# EAGLE design mini64se-v1.0.9-103-2s (EAGLE 6.3)
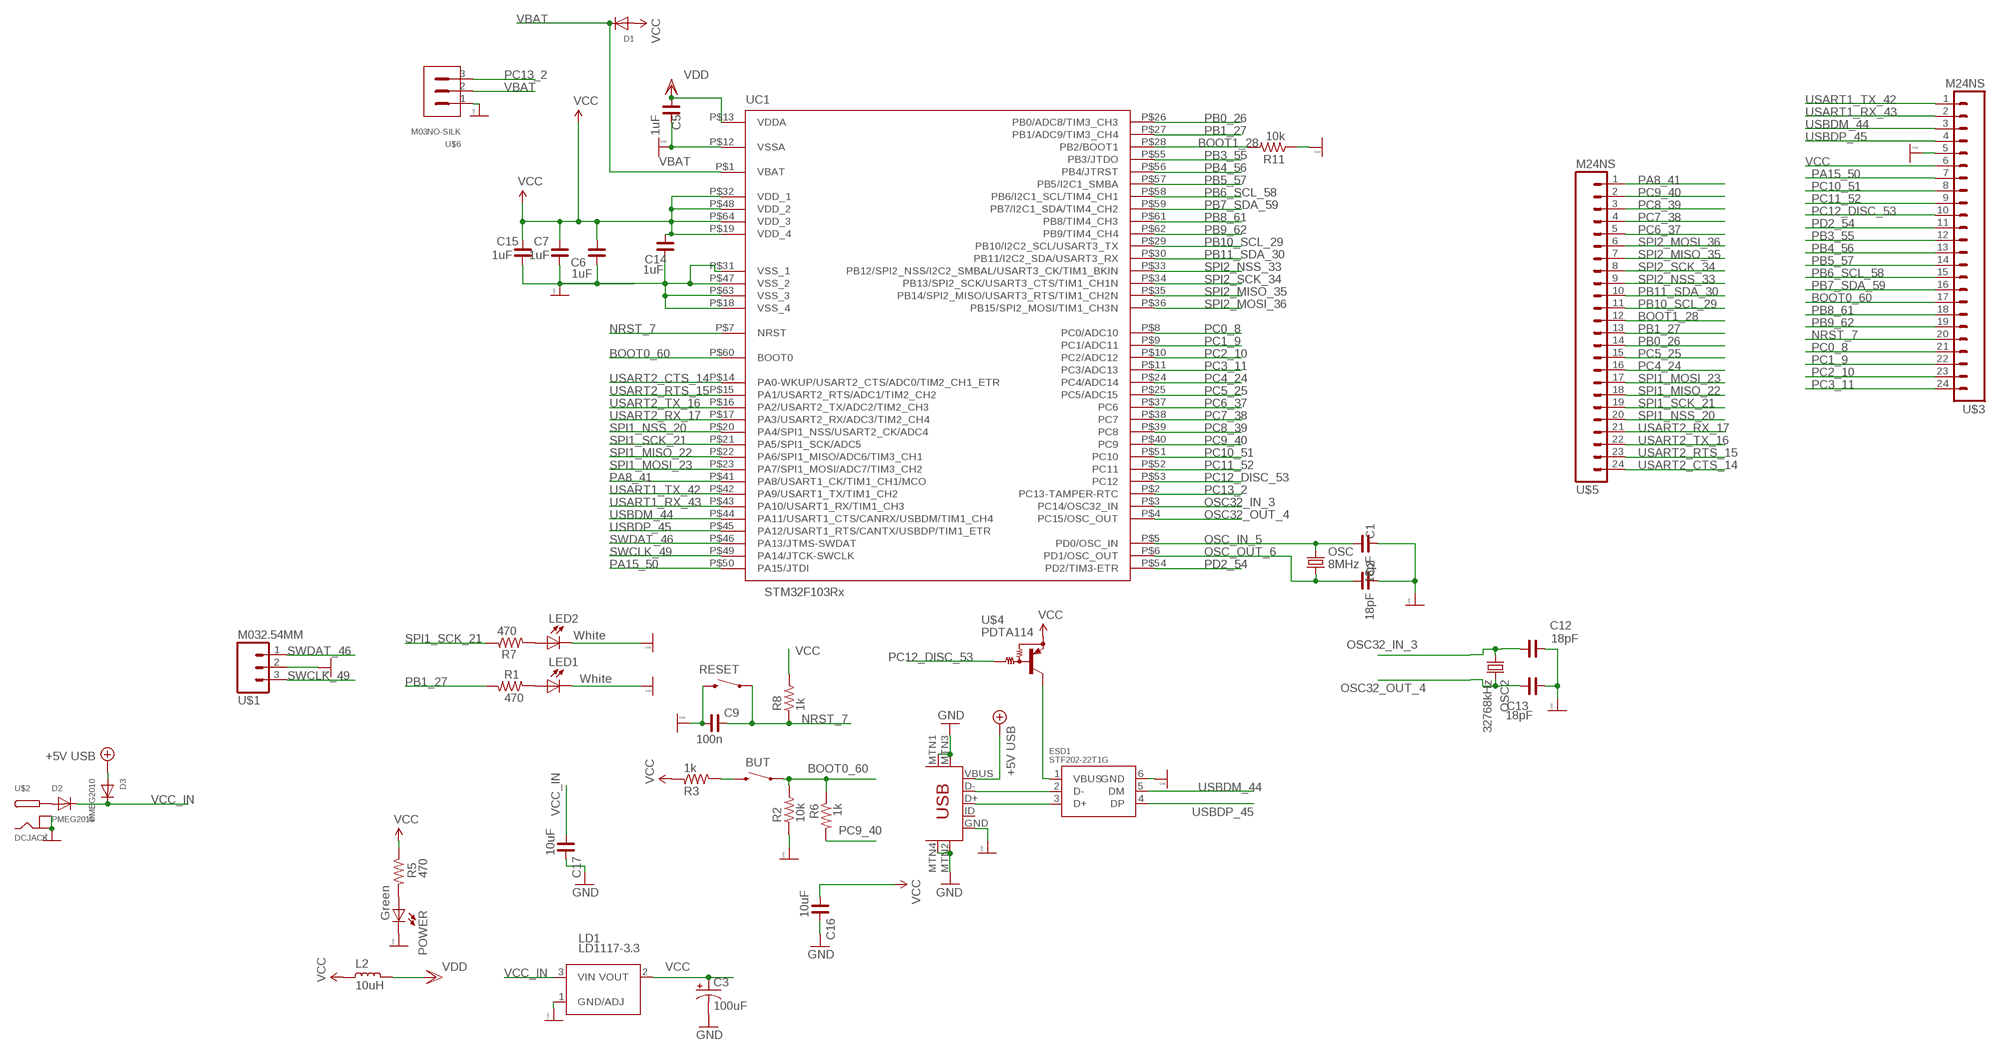
[diagram p0: schematic, sheet 1]

## Parts
BUT  SWITCH-MOMENTARY-2SMD  [TACTILE_SWITCH_SMD]
C1  18pF  C_0603  [C0603]
C2  18pF  C_0603  [C0603]
C3  100uF  CAP_POLC  [PANASONIC_C]
C5  1uF  C_0603  [C0603]
C6  1uF  C_0603  [C0603]
C7  1uF  C_0603  [C0603]
C9  100n  C_0603  [C0603]
C12  18pF  C_0603  [C0603]
C13  18pF  C_0603  [C0603]
C14  1uF  C_0603  [C0603]
C15  1uF  C_0603  [C0603]
C16  10uF  C_0805  [C0805]
C17  10uF  C_0805  [C0805]
D1  DIODESOD-323  [SOD-323]
D2  PMEG2010  DIODESOD-323  [SOD-323]
D3  PMEG2010  DIODESOD-323  [SOD-323]
ESD1  STF202-22T1G  STF202TSOP-6  [TSOP-6]
L2  10uH  L_PM0603  [PM0603]
LD1  LD1117-3.3  LD1117SOT223  [SOT223]
LED1  White  LEDKA-3528ASYC  [KA-3528ASYC]
LED2  White  LEDKA-3528ASYC  [KA-3528ASYC]
OSC  8MHz  CRYSTALHC49UV  [HC49U-V]
OSC2  32768kHz  CRYSTALTC26HM  [TC26H-M]
POWER  Green  LEDCHIPLED_0603  [CHIPLED_0603]
R1  470  R_0603  [R0603]
R2  10k  R_0603  [R0603]
R3  1k  R_0603  [R0603]
R5  470  R_0603  [R0603]
R6  1k  R_0603  [R0603]
R7  470  R_0603  [R0603]
R8  1k  R_0603  [R0603]
R11  10k  R_0603  [R0603]
RESET  SWITCH-MOMENTARY-2SMD  [TACTILE_SWITCH_SMD]
U$1  M032.54MM  M031X03_NO_SILK  [1X03_NO_SILK]
U$2  DCJACK  [DC-020-001]
U$3  M24NS  [1X24_NO_SILK]
U$4  PDTA114  PNP-DRIVERSOT23-3  [SOT23-3]
U$5  M24NS  [1X24_NO_SILK]
U$6  M03NO-SILK  [1X03_NO_SILK]
UC1  STM32F103Rx  STM32F103  [TQFP-10X10-64]
USB  USB-MINIB-5PIN  [USB-MINIB]

## Nets
+5V [vcc]: D3.A USB.VBUS ; supply symbol labelled +5V USB
BOOT0_60: BUT.1 R2.2 R6.1 U$3.17 UC1.P$60(BOOT0)
BOOT1_28: R11.2 U$5.12 UC1.P$28(PB2/BOOT1)
GND: C1.1 C2.1 C3.- C5.1 C6.1 C7.1 C9.1 C12.1 C13.1 C14.1 C15.1 C16.2 C17.2 ESD1.6(GND) LD1.1(GND/ADJ) LED1.C LED2.C POWER.C R2.1 R11.1 RESET.3 U$1.2 U$2.GND U$2.GNDBREAK U$3.5 U$6.1 UC1.P$12(VSSA) UC1.P$18(VSS_4) UC1.P$31(VSS_1) UC1.P$47(VSS_2) UC1.P$63(VSS_3) USB.GND USB.MTN1(MTN2) USB.MTN2(MTN3) USB.MTN3(MTN1) USB.MTN4
N$1: POWER.A R5.2
N$2: BUT.3 R3.2
N$3: LED2.A R7.2
N$4: LED1.A R1.1
N$5: ESD1.1(VBUS) U$4.3(C)
N$6: D2.A U$2.PWR
N$14: ESD1.2(D-) USB.D-
N$17: ESD1.3(D+) USB.D+
NRST_7: C9.2 R8.1 RESET.1 U$3.20 UC1.P$7(NRST)
OSC32_IN_3: C12.2 OSC2.1 UC1.P$3(PC14/OSC32_IN)
OSC32_OUT_4: C13.2 OSC2.2 UC1.P$4(PC15/OSC_OUT)
OSC_IN_5: C1.2 OSC.2 UC1.P$5(PD0/OSC_IN)
OSC_OUT_6: C2.2 OSC.1 UC1.P$6(PD1/OSC_OUT)
PA8_41: U$5.1 UC1.P$41(PA8/USART1_CK/TIM1_CH1/MCO)
PA15_50: U$3.7 UC1.P$50(PA15/JTDI)
PB0_26: U$5.14 UC1.P$26(PB0/ADC8/TIM3_CH3)
PB1_27: R1.2 U$5.13 UC1.P$27(PB1/ADC9/TIM3_CH4)
PB3_55: U$3.12 UC1.P$55(PB3/JTDO)
PB4_56: U$3.13 UC1.P$56(PB4/JTRST)
PB5_57: U$3.14 UC1.P$57(PB5/I2C1_SMBA)
PB6_SCL_58: U$3.15 UC1.P$58(PB6/I2C1_SCL/TIM4_CH1)
PB7_SDA_59: U$3.16 UC1.P$59(PB7/I2C1_SDA/TIM4_CH2)
PB8_61: U$3.18 UC1.P$61(PB8/TIM4_CH3)
PB9_62: U$3.19 UC1.P$62(PB9/TIM4_CH4)
PB10_SCL_29: U$5.11 UC1.P$29(PB10/I2C2_SCL/USART3_TX)
PB11_SDA_30: U$5.10 UC1.P$30(PB11/I2C2_SDA/USART3_RX)
PC0_8: U$3.21 UC1.P$8(PC0/ADC10)
PC1_9: U$3.22 UC1.P$9(PC1/ADC11)
PC2_10: U$3.23 UC1.P$10(PC2/ADC12)
PC3_11: U$3.24 UC1.P$11(PC3/ADC13)
PC4_24: U$5.16 UC1.P$24(PC4/ADC14)
PC5_25: U$5.15 UC1.P$25(PC5/ADC15)
PC6_37: U$5.5 UC1.P$37(PC6)
PC7_38: U$5.4 UC1.P$38(PC7)
PC8_39: U$5.3 UC1.P$39(PC8)
PC9_40: R6.2 U$5.2 UC1.P$40(PC9)
PC10_51: U$3.8 UC1.P$51(PC10)
PC11_52: U$3.9 UC1.P$52(PC11)
PC12_DISC_53: U$3.10 U$4.1(B) UC1.P$53(PC12)
PC13_2: U$6.3 UC1.P$2(PC13-TAMPER-RTC)
PD2_54: U$3.11 UC1.P$54(PD2/TIM3-ETR)
SPI1_MISO_22: U$5.18 UC1.P$22(PA6/SPI1_MISO/ADC6/TIM3_CH1)
SPI1_MOSI_23: U$5.17 UC1.P$23(PA7/SPI1_MOSI/ADC7/TIM3_CH2)
SPI1_NSS_20: U$5.20 UC1.P$20(PA4/SPI1_NSS/USART2_CK/ADC4)
SPI1_SCK_21: R7.1 U$5.19 UC1.P$21(PA5/SPI1_SCK/ADC5)
SPI2_MISO_35: U$5.7 UC1.P$35(PB14/SPI2_MISO/USART3_RTS/TIM1_CH2N)
SPI2_MOSI_36: U$5.6 UC1.P$36(PB15/SPI2_MOSI/TIM1_CH3N)
SPI2_NSS_33: U$5.9 UC1.P$33(PB12/SPI2_NSS/I2C2_SMBAL/USART3_CK/TIM1_BKIN)
SPI2_SCK_34: U$5.8 UC1.P$34(PB13/SPI2_SCK/USART3_CTS/TIM1_CH1N)
SWCLK_49: U$1.3 UC1.P$49(PA14/JTCK-SWCLK)
SWDAT_46: U$1.1 UC1.P$46(PA13/JTMS-SWDAT)
USART1_RX_43: U$3.2 UC1.P$43(PA10/USART1_RX/TIM1_CH3)
USART1_TX_42: U$3.1 UC1.P$42(PA9/USART1_TX/TIM1_CH2)
USART2_CTS_14: U$5.24 UC1.P$14(PA0-WKUP/USART2_CTS/ADC0/TIM2_CH1_ETR)
USART2_RTS_15: U$5.23 UC1.P$15(PA1/USART2_RTS/ADC1/TIM2_CH2)
USART2_RX_17: U$5.21 UC1.P$17(PA3/USART2_RX/ADC3/TIM2_CH4)
USART2_TX_16: U$5.22 UC1.P$16(PA2/USART2_TX/ADC2/TIM2_CH3)
USBDM_44: ESD1.5(DM) U$3.3 UC1.P$44(PA11/USART1_CTS/CANRX/USBDM/TIM1_CH4)
USBDP_45: ESD1.4(DP) U$3.4 UC1.P$45(PA12/USART1_RTS/CANTX/USBDP/TIM1_ETR)
VBAT: D1.C U$6.2 UC1.P$1(VBAT)
VCC [vcc]: C3.+ C6.2 C7.2 C14.2 C15.2 C16.1 D1.A L2.2 LD1.2(VOUT) R3.1 R5.1 R8.2 U$3.6 U$4.2(E) UC1.P$19(VDD_4) UC1.P$32(VDD_1) UC1.P$48(VDD_2) UC1.P$64(VDD_3)
VCC_IN [vcc]: C17.1 D2.C D3.C LD1.3(VIN)
VDD [vcc]: C5.2 L2.1 UC1.P$13(VDDA)
Unconnected: USB.ID

## Library data of the parts
BUT RESET = es:SWITCH-MOMENTARY-2
C1 C2 C5-C7 C9 C12-C17 = rc-master-smd:C_: NON-POLARIZED CAP
C3 = es:CAP_POL: Capacitor Polarized These are standard SMD and PTH capacitors. Normally 10uF, 47uF, and 100uF in electrolytic and tantalum varieties. Always verify the external diameter of the through hole cap, it varies with capacity, voltage, and manufacturer. The EIA devices should be standard.
D1-D3 = es:DIODE: Diode SMADIODE - SMA Surface Mount Package 20V 1A Schottky Diode Digikey: 641-1014-6-ND DO-1N4148 - Through Hole Small Current Diode SOD-123 20V 1 A (.5mV Vf) Schottky Diode - Digikey: MBRX120TPMSCT-ND SOD-323 10V 570mA (.38mV Vf, 3ns) Schottky Diode - Digikey: ZLLS410CT-ND SOD-523 30V 30mA Schottky Diode (RB751S-40TE61) - Digikey: RB751S-40TE61CT-ND SOT23-R/W - SOT23 Package (R = Solder Paste/Reflow Ovens, W = Hand-Soldering) BAT54Film 40V 300mA - Digikey: 497-7162-1-ND
ESD1 = es:STF202
L2 = rc-master-smd:L_: INDUCTOR
LD1 = es:LD1117
LED1 LED2 POWER = led:LED: LED OSRAM: - CHIPLED LG R971, LG N971, LY N971, LG Q971, LY Q971, LO R971, LY R971 LH N974, LH R974 LS Q976, LO Q976, LY Q976 LO Q996 - Hyper CHIPLED LW Q18S LB Q993, LB Q99A, LB R99A - SideLED LS A670, LO A670, LY A670, LG A670, LP A670 LB A673, LV A673, LT A673, LW A673 LH A674 LY A675 LS A676, LA A676, LO A676, LY A676, LW A676 LS A679, LY A679, LG A679 - Hyper Micro SIDELED® LS Y876, LA Y876, LO Y876, LY Y876 LT Y87S - SmartLED LW L88C, LW L88S LB L89C, LB L89S, LG L890 LS L89K, LO L89K, LY L89K LS L896, LA L896, LO L896, LY L896 - TOPLED LS T670, LO T670, LY T670, LG T670, LP T670 LSG T670, LSP T670, LSY T670, LOP T670, LYG T670 LG T671, LOG T671, LSG T671 LB T673, LV T673, LT T673, LW T673 LH T674 LS T676, LA T676, LO T676, LY T676, LB T676, LH T676, LSB T676, LW T676 LB T67C, LV T67C, LT T67C, LS T67K, LO T67K, LY T67K, LW E67C LS E67B, LA E67B, LO E67B, LY E67B, LB E67C, LV E67C, LT E67C LW T67C LS T679, LY T679, LG T679 LS T770, LO T770, LY T770, LG T770, LP T770 LB T773, LV T773, LT T773, LW T773 LH T774 LS E675, LA E675, LY E675, LS T675 LS T776, LA T776, LO T776, LY T776, LB T776 LHGB T686 LT T68C, LB T68C - Hyper Mini TOPLED® LB M676 - Mini TOPLED Santana® LG M470 LS M47K, LO M47K, LY M47K Source: http://www.osram.convergy.de LUXEON: - LUMILED® LXK2-PW12-R00, LXK2-PW12-S00, LXK2-PW14-U00, LXK2-PW14-V00 LXK2-PM12-R00, LXK2-PM12-S00, LXK2-PM14-U00 LXK2-PE12-Q00, LXK2-PE12-R00, LXK2-PE12-S00, LXK2-PE14-T00, LXK2-PE14-U00 LXK2-PB12-K00, LXK2-PB12-L00, LXK2-PB12-M00, LXK2-PB14-N00, LXK2-PB14-P00, LXK2-PB14-Q00 LXK2-PR12-L00, LXK2-PR12-M00, LXK2-PR14-Q00, LXK2-PR14-R00 LXK2-PD12-Q00, LXK2-PD12-R00, LXK2-PD12-S00 LXK2-PH12-R00, LXK2-PH12-S00 LXK2-PL12-P00, LXK2-PL12-Q00, LXK2-PL12-R00 Source: www.luxeon.com KINGBRIGHT: KA-3528ASYC Source: www.kingbright.com
OSC OSC2 = SparkFun_20110922_my:CRYSTAL: Crystals Various standard crystals. Proven footprints. Spark Fun Electronics SKU : COM-00534
R1-R3 R5-R8 R11 = rc-master-smd:R_: RESISTOR
U$1 = SparkFun_20110922_my:M03: Header 3 Standard 3-pin 0.1" header. Use with straight break away headers (SKU : PRT-00116), right angle break away headers (PRT-00553), swiss pins (PRT-00743), machine pins (PRT-00117), and female headers (PRT-00115). Molex polarized connector foot print use with SKU : PRT-08232 with associated crimp pins and housings.
U$2 = es:DCJACK
U$3 U$5 = SparkFun_20110922_my:M24
U$4 = es:PNP-DRIVER
U$6 = es:M03
UC1 = st-microelectronics:STM32F103
USB = SparkFun_20110922_my:USB-MINIB: Mini-USB "B" connector with 5th pin broken out. Created new symbol breaking out 5th "ID" pin in mini/micro USB connector spec. See: http://en.wikipedia.org/wiki/Mini_usb#Cables. Uses same footprint as 4-pin symbol. Also added pins to connect to mounting / shield pads if required (probably not generally needed as signals aren't shielded once they leave the connector).

## Net classes
1 vcc: width 0.3 mm

## Board
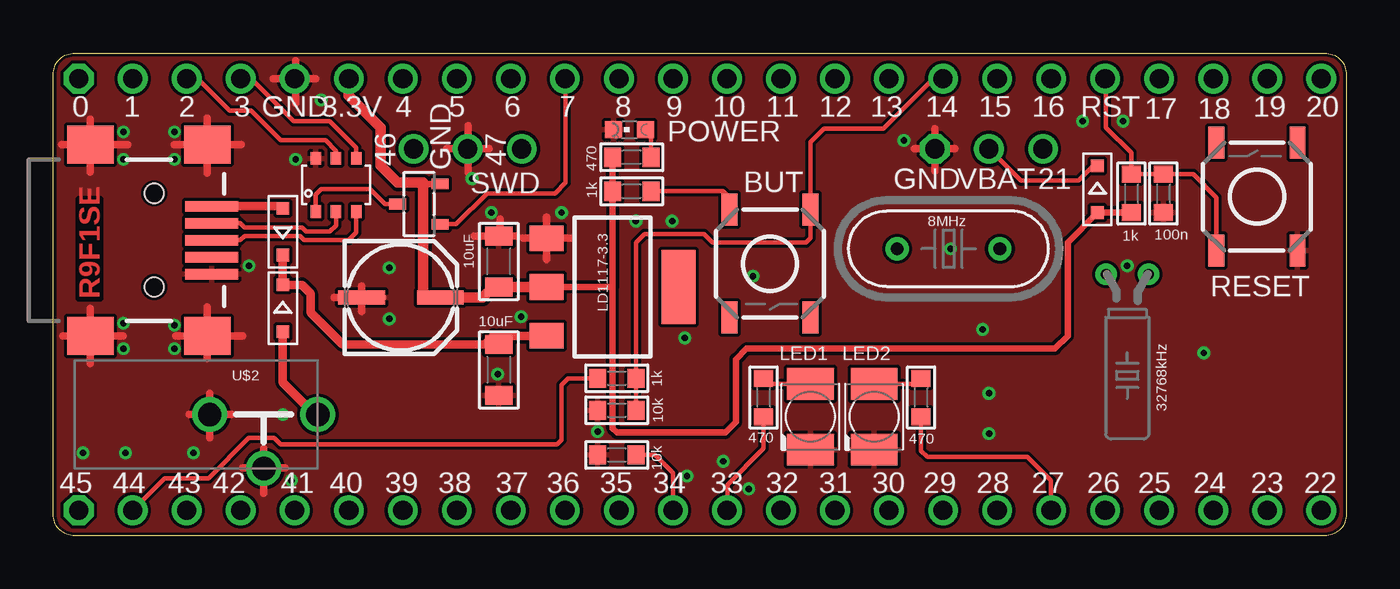
[diagram p1: board, top side]
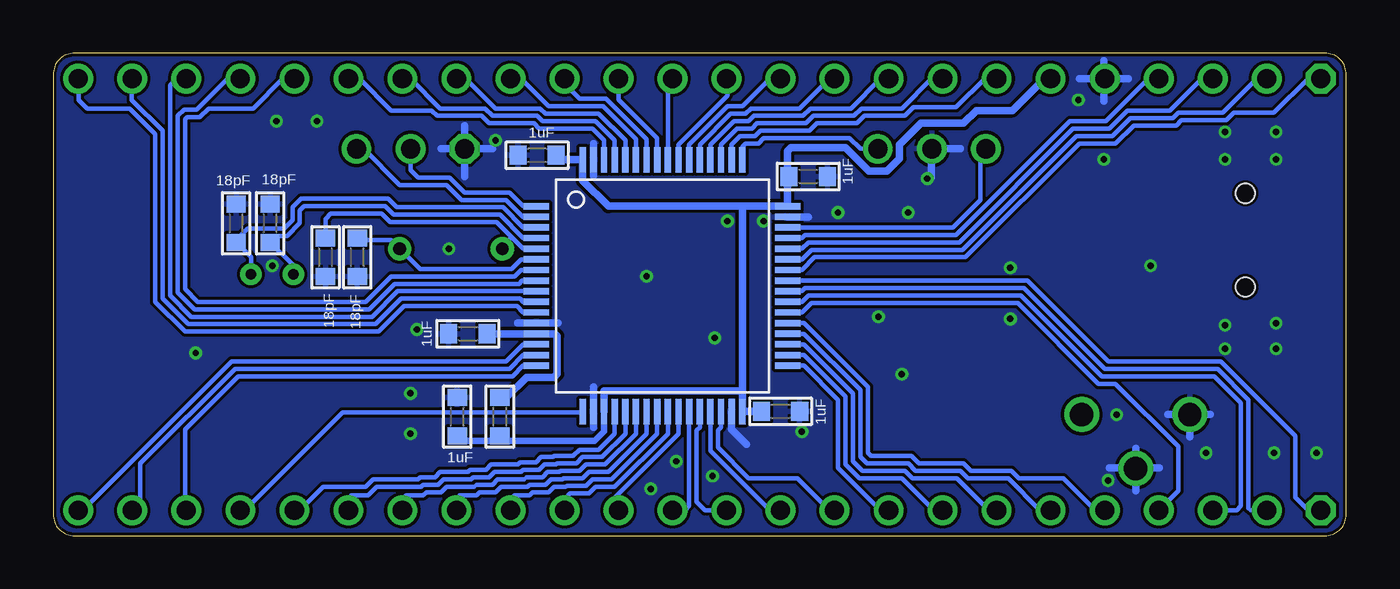
[diagram p2: board, bottom side, seen from below]

Size 60.8 x 22.7 mm. Coordinates in mm from the lower left corner, seen from the top.
Outline: 1,22.7 59.8,22.7 arc-90 60.8,21.7 60.8,1 arc-90 59.8,0 1,0 arc-90 0,1 0,21.7 arc-90 1,22.7
Copper layers (1+2*3+16): Top 0.07mm / dielectric 9mil / Route2 0.07mm / dielectric 35mil / Route3 0.07mm / dielectric 9mil / Bottom 0.07mm
Design rules "es-015mm *": minimum track width 0.15mm, minimum drill 0.3mm, track to track 0.15mm, track to pad 0.15mm, pad to pad 0.15mm, via to via 0.15mm, smd to smd 0.15mm, copper to edge 0.15mm, drill to drill 0.15mm, minimum pad ring 0.25mm, minimum via ring 0.15mm, stop-mask expansion 0mil, vias tented up to drill 25mil, thermal gap 0.15mm

### Footprints (pad centres in the part's own frame; a part is rotated, then mirrored left to right if it is on the bottom)
TACTILE_SWITCH_SMD = smd 1.5 x 0.75: 1 -2.54,1.905; 2 2.54,1.905; 3 -2.54,-1.905; 4 2.54,-1.905
C0603 = smd 0.8 x 0.9: 1 -0.9,0; 2 0.9,0
PANASONIC_C = smd 2.2 x 0.65: + 1.9,0; - -1.8,0
C0805 = smd 0.9 x 1.3: 1 -1.2,0; 2 1.2,0
SOD-323 = smd 0.6 x 0.6: A 1.1,0; C -1.1,0
TSOP-6 = smd 0.5 x 0.6: 1 -0.95,-1.25; 2 0,-1.25; 3 0.95,-1.25; 4 0.95,1.25; 5 0,1.25; 6 -0.95,1.25
PM0603 = smd 0.8 x 0.9: 1 -0.9,0; 2 0.9,0
SOT223 = smd 1.2 x 1.6: 1 -2.3,-3.1; 2 0,-3.1; 3 2.3,-3.1 | smd 3.5 x 1.6: 4 0,3.1
KA-3528ASYC = smd 1.5 x 2.2: A -1.55,0; C 1.55,0
HC49U-V = drill 0.6: 1 -2.413,0; 2 2.413,0
TC26H-M = drill 0.5: 1 -1,0; 2 1,0
CHIPLED_0603 = smd 0.8 x 0.8: A 0,-0.75; C 0,0.75
R0603 = smd 0.8 x 0.9: 1 -0.9,0; 2 0.9,0
1X03_NO_SILK = drill 0.9: 1 0,0; 2 2.54,0; 3 5.08,0
DC-020-001 = drill 1.1: GND 0,-2.54; GNDBREAK 2.54,0; PWR 0,2.54
1X24_NO_SILK = drill 0.9 octagon: 1 -29.2,0 | drill 0.9: 2 -26.66,0; 3 -24.12,0; 4 -21.58,0; 5 -19.04,0; 6 -16.5,0; 7 -13.96,0; 8 -11.42,0; 9 -8.88,0; 10 -6.34,0; 11 -3.8,0; 12 -1.26,0; 13 1.28,0; 14 3.82,0; 15 6.36,0; 16 8.9,0; 17 11.44,0; 18 13.98,0; 19 16.52,0; 20 19.06,0; 21 21.6,0; 22 24.14,0; 23 26.68,0; 24 29.22,0
SOT23-3 = smd 0.5 x 0.8: 1 -0.95,-1; 2 0.95,-1; 3 0,1
1X03_NO_SILK' = drill 0.9 octagon: 1 -2.54,0 | drill 0.9: 2 0,0; 3 2.54,0
TQFP-10X10-64 = smd 1.2 x 0.3: P$1 -5.936,3.75; P$2 -5.936,3.25; P$3 -5.936,2.75; P$4 -5.936,2.25; P$5 -5.936,1.75; P$6 -5.936,1.25; P$7 -5.936,0.75; P$8 -5.936,0.25; P$9 -5.936,-0.25; P$10 -5.936,-0.75; P$11 -5.936,-1.25; P$12 -5.936,-1.75; P$13 -5.936,-2.25; P$14 -5.936,-2.75; P$15 -5.936,-3.25; P$16 -5.936,-3.75; P$33 5.886,-3.75; P$34 5.886,-3.25; P$35 5.886,-2.75; P$36 5.886,-2.25; P$37 5.886,-1.75; P$38 5.886,-1.25; P$39 5.886,-0.75; P$40 5.886,-0.25; P$41 5.886,0.25; P$42 5.886,0.75; P$43 5.886,1.25; P$44 5.886,1.75; P$45 5.886,2.25; P$46 5.886,2.75; P$47 5.886,3.25; P$48 5.886,3.75 | smd 0.3 x 1.2: P$17 -3.75,-5.911; P$18 -3.25,-5.911; P$19 -2.75,-5.911; P$20 -2.25,-5.911; P$21 -1.75,-5.911; P$22 -1.25,-5.911; P$23 -0.75,-5.911; P$24 -0.25,-5.911; P$25 0.25,-5.911; P$26 0.75,-5.911; P$27 1.25,-5.911; P$28 1.75,-5.911; P$29 2.25,-5.911; P$30 2.75,-5.911; P$31 3.25,-5.911; P$32 3.75,-5.911; P$49 3.75,5.936; P$50 3.25,5.936; P$51 2.75,5.936; P$52 2.25,5.936; P$53 1.75,5.936; P$54 1.25,5.936; P$55 0.75,5.936; P$56 0.25,5.936; P$57 -0.25,5.936; P$58 -0.75,5.936; P$59 -1.25,5.936; P$60 -1.75,5.936; P$61 -2.25,5.936; P$62 -2.75,5.936; P$63 -3.25,5.936; P$64 -3.75,5.936
USB-MINIB = smd 2.5 x 0.5: D+ 2.7,0; D- 2.7,0.8; GND 2.7,-1.6; ID 2.7,-0.8; VBUS 2.7,1.6 | smd 2.2 x 1.8: MTN1 -3,4.5; MTN2 2.5,4.5; MTN3 -3,-4.5; MTN4 2.5,-4.5 | hole 0.9: 0,2.2; 0,-2.2

### Placement (x,y rotation side)
BUT  33.7,12.8 270 top
C1  48,13.1 90 bottom
C2  46.5,13.1 90 bottom
C3  16.3,11.2 0 top
C5  41.3,9.5 0 bottom
C6  25.3,16.9 180 bottom
C7  26.6,5.85 180 bottom
C9  52.2,16.1 90 top
C12  52.2,14.7 270 bottom
C13  50.6,14.7 270 bottom
C14  38.05,17.9 0 bottom
C15  41.8,5.6 270 bottom
C16  20.95,12.9 90 top
C17  20.95,7.8 270 top
D1  49.1,16.3 270 top
D2  10.8,10.7 270 top
D3  10.8,14.3 90 top
ESD1  13.3,16.5 0 top
L2  39.8,5.6 270 bottom
LD1  26.3,11.7 270 top
LED1  35.6,5.6 270 top
LED2  38.6,5.6 270 top
OSC  42.1,13.5 180 top
OSC2  50.5,12.3 180 top
POWER  27.1,19.1 90 top
R1  33.4,6.5 270 top
R2  26.5,5.9 0 top
R3  27.2,16.2 0 top
R5  27.2,17.8 0 top
R6  26.5,7.4 180 top
R7  40.8,6.5 90 top
R8  50.7,16.1 270 top
R11  26.5,3.8 0 top
RESET  56.6,15.95 90 top
U$1  16.95,18.2 0 top
U$2  9.9,5.7 270 top
U$3  30.4,21.5 0 top
U$4  17.2,15.6 90 top
U$5  30.4,1.2 180 bottom
U$6  M03NO-SILK  [1X03_NO_SILK']  44,18.2 0 top
UC1  32.15,11.75 0 bottom
USB  4.75,13.9 0 top

### Tracks (layer width: path | path; a pad name or v marks a point on that pad's centre or on a via)
+5V
  Top 0.4: USB.VBUS 10.7,15.5 D3.A
BOOT0_60
  Top 0.2: U$3.17 41.39,21.5 39.04,19.15 36.25,19.15 35.6,18.5 BUT.1 35.6,14 35.4,13.8 31,13.8 30.6,14.2 27.8,14.2 27.4,13.8 R6.1 R2.2
  Bottom 0.2: UC1.P$60 33.9,18.6 35.15,19.85 37.65,19.85 37.9,20.1 40,20.1 41.4,21.5 U$3.17
BOOT1_28
  Top 0.2: U$5.12 29.14,2.96 28.3,3.8 R11.2
  Bottom 0.2: UC1.P$28 30.4,5.1 30.55,4.95 30.55,1.6 30.15,1.2 U$5.12
GND  (via drill 0.3)
  Top 0.35: 8.85,18.4 7.95,18.4 | 7.25,19.65 7.25,18.75 | 7.25,17.95 7.25,17.05 | 7.25,10.75 7.25,9.85 | 7.25,8.85 7.25,8.35 | 8,9.4 8.9,9.4 | 5.75,9.4 6.65,9.4 | 5.7,18.4 6.6,18.4 | 2.6,18.4 3.5,18.4 | 0.4,18.4 1.2,18.4 | 2.4,9.4 3.3,9.4 | 0.45,9.4 1.3,9.4 | 1.75,10.7 1.75,9.8 | 1.75,9 1.75,8.1 | 1.75,18 1.75,17.1 | 1.75,19.6 1.75,18.7 | 8.9,3.2 10.9,3.2 | 9.9,4.1 9.9,2 | 14.5,11.75 C3.- | C3.- 14.5,10.55 | 15.5,11.2 C3.- | C3.- 13.2,11.2 | 23.2,13 23.2,13.9 | 23.2,14.1 23.2,15 | 24.4,14 23.5,14 | 23,14 22.1,14 | 21,14.9 21,14 | 19.8,14.1 20.7,14.1 | 20.9,14.1 21.8,14.1 | 19.5,17.1 19.5,18 | U$1.2 19.5,19.3 | 20.5,18.2 19.6,18.2 | 19.4,18.2 18.5,18.2 | 41.4,18.2 40.5,18.2 | 42.4,18.2 41.5,18.2 | 41.45,19.15 41.45,18.25 | 10.35,21.5 11.25,21.5 | 11.45,21.5 12.35,21.5 | 11.4,21.55 11.4,22.35 | 11.4,20.35 11.4,21.3 | 41.45,18.05 41.45,17.15 | 6.4,5.7 8.4,5.7 | 7.35,6.7 7.35,4.6
  Bottom 0.35: 35.4,5.1 35.4,7 | 35.4,16.95 35.4,18.45 | 37.06,10 38.96,10 | 19.5,16.85 19.5,18.35 | 19.65,18.2 18.15,18.2 | 42.55,18.2 40.15,18.2 | 41.45,19.3 41.45,16.9 | 11.4,22.35 11.4,20.45 | 10.25,21.5 12.55,21.5 | 11.15,3.2 8.8,3.2 | 9.9,2.1 9.9,4.1 | UC1.P$31 28.9,5 28.2,4.3 | UC1.P$47 25.3,15 | 8.4,5.7 6.4,5.7 | 7.35,6.3 7.35,4.65
  other vias: 3.3,17.7 3.3,19 5.7,19 5.7,17.7 3.3,10 3.3,8.8 5.7,9.9 5.7,8.8 9.2,12.7 15.8,10.2 23.9,15.2 20.6,15.2 27.4,14.8 29.1,14.8 32.9,12.2 22,10.3 29.7,9.3 42.2,13.5 50.5,12.7 40,18.6 48.4,19.5 50.3,19.5 54.1,8.6 44,6.7 44,4.8 43.7,9.7 25.6,4.9 29.8,2.8 31.5,3.5 32.7,2.2 12.6,20.5 11.4,17.7 19.7,16.8 20.9,7.6 6.6,3.9 3.4,3.9 10.8,5.7 11.2,2.6 1.4,3.9 15.8,12.6
  pour Bottom: 60.8,22.7 60.8,0 0,0 0,22.7
  pour Top: 60.8,22.7 60.8,0 0,0 0,22.7
N$1
  Top 0.2: R5.2 28.1,18.85 POWER.A
N$2
  Top 0.2: R3.2 31.5,16.2 31.8,15.9 BUT.3
N$3
  Top 0.2: LED2.A 40.55,7.15 R7.2
N$4
  Top 0.2: LED1.A 33.65,7.15 R1.1
N$5
  Top 0.2: ESD1.1 12.35,16.05 12.6,16.3 14.9,16.3 15.6,15.6 U$4.3
N$6
  Top 0.4: U$2.PWR 12.3,5.7 10.8,7.2 D2.A
N$14
  Top 0.2: USB.D- 8.8,14.7 9,14.5 11.7,14.5 11.9,14.3 13,14.3 13.3,14.6 ESD1.2
N$17
  Top 0.2: USB.D+ 8.8,13.9 9,14.1 11.6,14.1 11.8,13.9 13.9,13.9 14.25,14.25 ESD1.3
NRST_7
  Top 0.2: U$3.20 49.5,21.46 49.5,19.2 49.51,19.2 50.7,18.01 R8.1 C9.2 53.6,17 54.7,15.9 RESET.1
  Bottom 0.2: UC1.P$7 38.8,12.5 39.1,12.2 44.9,12.2 46.1,11 54,11 54.6,11.6 54.6,19.6 54.5,19.7 53.9,19.7 53.5,20.1 51.4,20.1 50,21.5 U$3.20
OSC32_IN_3
  Bottom 0.2: UC1.P$3 38.7,14.5 39.65,15.45 44.65,15.45 45.05,15.85 49.15,15.85 49.55,15.45 49.55,14.85 49.95,14.45 51.65,14.45 52.2,13.9 C12.2 51.5,13.1 OSC2.1
OSC32_OUT_4
  Bottom 0.2: UC1.P$4 38.7,14 39.8,15.1 44.8,15.1 45.2,15.5 49,15.5 49.2,15.3 49.2,14.7 49.8,14.1 50.3,14.1 C13.2 49.5,12.7 OSC2.2
OSC_IN_5
  Bottom 0.2: UC1.P$5 38.7,13.5 39.25,14.05 | 39.25,14.05 39.95,14.75 44.95,14.75 45.35,15.15 47.75,15.15 48,14.9 C1.2 | OSC.2 39.69,13.61 39.25,14.05
OSC_OUT_6
  Bottom 0.2: UC1.P$6 38.8,13 39.25,12.55 43.55,12.55 OSC.1 | C2.2 46.5,13.9 44.9,13.9 OSC.1 | OSC.1
PA8_41
  Bottom 0.2: U$5.1 1.8,1.2 2.4,1.8 2.4,4.7 5.9,8.2 11.2,8.2 15,12 UC1.P$41
PA15_50
  Bottom 0.2: UC1.P$50 28.9,18.4 28.5,18.8 27.8,18.8 27.55,19.05 25.25,19.05 24.9,19.4 23,19.4 22.65,19.75 20.75,19.75 20.35,20.15 18.35,20.15 17,21.5 U$3.7
PB0_26
  Bottom 0.2: UC1.P$26 31.4,4.8 34.5,1.7 34.5,1.2 U$5.14
PB1_27
  Top 0.2: R1.2 33.4,4.1 31.7,2.4 31.7,1.22 U$5.13
  Bottom 0.2: UC1.P$27 30.9,1.4 31.1,1.2 U$5.13
PB3_55
  Bottom 0.2: UC1.P$55 31.4,18.4 29.1,20.7 29.1,21.46 U$3.12
PB4_56
  Bottom 0.2: UC1.P$56 31.9,21.28 U$3.13
PB5_57
  Bottom 0.2: U$3.14 34.22,20.52 32.4,18.7 UC1.P$57
PB6_SCL_58
  Bottom 0.2: UC1.P$58 32.9,18.65 34.8,20.55 36.05,20.55 36.8,21.3 36.8,21.46 U$3.15
PB7_SDA_59
  Bottom 0.2: UC1.P$59 33.4,18.65 34.95,20.2 37.5,20.2 38.8,21.5 U$3.16
PB8_61
  Bottom 0.2: UC1.P$61 34.4,18.6 35.3,19.5 37.8,19.5 38.05,19.75 40.15,19.75 40.5,20.1 42.6,20.1 44,21.5 U$3.18
PB9_62
  Bottom 0.2: UC1.P$62 34.9,18.6 35.45,19.15 37.95,19.15 38.2,19.4 40.3,19.4 40.65,19.75 42.75,19.75 43,20 44.9,20 46.4,21.5 U$3.19
PB10_SCL_29
  Bottom 0.2: UC1.P$29 29.9,4 27.1,1.2 U$5.11
PB11_SDA_30
  Bottom 0.2: UC1.P$30 29.4,5.1 29.55,4.95 29.55,4.15 28.1,2.7 25.8,2.7 24.3,1.2 U$5.10
PC0_8
  Bottom 0.2: UC1.P$8 38.75,12 38.9,11.85 44.75,11.85 45.95,10.65 54.15,10.65 54.95,11.45 54.95,19.75 54.65,20.05 54.05,20.05 52.6,21.5 U$3.21
PC1_9
  Bottom 0.2: UC1.P$9 44.6,11.5 45.8,10.3 54.3,10.3 55.3,11.3 55.3,21.2 55,21.5 U$3.22
PC2_10
  Bottom 0.2: UC1.P$10 38.7,11 38.85,11.15 44.45,11.15 45.65,9.95 54.45,9.95 55.65,11.15 55.65,19.05 57.1,20.5 57.1,21.48 U$3.23
PC3_11
  Bottom 0.2: UC1.P$11 38.7,10.5 39,10.8 44.3,10.8 45.5,9.6 54.6,9.6 56,11 56,18.9 57.2,20.1 59.2,20.1 59.6,20.5 59.6,21.48 U$3.24
PC4_24
  Bottom 0.2: UC1.P$24 32.4,4.8 34.55,2.65 35.45,2.65 35.75,2.35 36.65,2.35 36.7,2.3 37.25,2.3 37.5,2.05 38.25,2.05 38.4,1.9 39.1,1.9 39.2,1.8 39.2,1.2 U$5.16
PC5_25
  Bottom 0.2: UC1.P$25 31.9,4.8 34.4,2.3 35.3,2.3 35.6,2 36.5,2 36.6,1.9 36.6,1.2 U$5.15
PC6_37
  Bottom 0.2: UC1.P$37 25.5,10 22.5,7 22.5,3.9 22.35,3.75 20.45,3.75 20.1,3.4 18,3.4 17.65,3.05 15.75,3.05 15.4,2.7 13.3,2.7 11.8,1.2 U$5.5
PC7_38
  Bottom 0.2: UC1.P$38 25.6,10.5 25.15,10.95 15.45,10.95 11.65,7.15 10.85,7.15 7.9,4.2 7.9,2.12 U$5.4
PC8_39
  Bottom 0.2: UC1.P$39 25.6,11 25.3,11.3 15.3,11.3 11.5,7.5 6.2,7.5 4.95,6.25 4.95,1.4 5.15,1.2 U$5.3
PC9_40
  Top 0.2: U$5.2 5.24,2.7 7.3,2.7 9.2,4.6 10.4,4.6 10.7,4.3 23.7,4.3 23.9,4.5 23.9,7.1 24.2,7.4 R6.2
  Bottom 0.2: U$5.2 4.5,1.2 4.6,1.3 4.6,6.4 6.05,7.85 11.35,7.85 15.15,11.65 25.45,11.65 25.6,11.5 UC1.P$40
PC10_51
  Bottom 0.2: UC1.P$51 29.4,18.4 28.65,19.15 27.95,19.15 27.7,19.4 25.4,19.4 25.05,19.75 23.15,19.75 22.8,20.1 20.9,20.1 19.5,21.5 U$3.8
PC11_52
  Bottom 0.2: UC1.P$52 29.9,18.4 28.8,19.5 28.1,19.5 27.85,19.75 25.55,19.75 25.2,20.1 23.3,20.1 21.9,21.5 U$3.9
PC12_DISC_53
  Top 0.2: U$4.1 18.95,14.65 20.4,16.1 23.6,16.1 24.1,16.6 24.1,21.46 U$3.10
  Bottom 0.2: UC1.P$53 30.4,18.4 28.95,19.85 28.25,19.85 28,20.1 25.7,20.1 24.3,21.5 U$3.10
PC13_2
  Bottom 0.2: UC1.P$2 38.7,15 39.5,15.8 41.6,15.8 42.3,16.5 44.5,16.5 46.2,18.2 U$6.3
PD2_54
  Bottom 0.2: UC1.P$54 30.9,18.4 29.1,20.2 28.4,20.2 27.1,21.5 U$3.11
SPI1_MISO_22
  Bottom 0.2: UC1.P$22 33.4,4.8 34.85,3.35 35.75,3.35 36.05,3.05 36.95,3.05 37,3 37.55,3 37.8,2.75 38.55,2.75 38.65,2.65 39.9,2.65 40.15,2.4 40.9,2.4 41,2.3 42.3,2.3 42.55,2.05 43.25,2.05 43.4,1.9 44.2,1.9 44.3,1.8 44.3,1.2 U$5.18
SPI1_MOSI_23
  Bottom 0.2: UC1.P$23 32.9,4.8 34.7,3 35.6,3 35.9,2.7 36.8,2.7 36.85,2.65 37.4,2.65 37.65,2.4 38.4,2.4 38.5,2.3 39.75,2.3 40,2.05 40.75,2.05 40.9,1.9 41.7,1.9 41.8,1.8 41.8,1.2 U$5.17
SPI1_NSS_20
  Bottom 0.2: UC1.P$20 34.4,4.8 35.15,4.05 36.05,4.05 36.35,3.75 37.25,3.75 37.3,3.7 37.85,3.7 38.1,3.45 38.85,3.45 38.95,3.35 40.2,3.35 40.45,3.1 41.2,3.1 41.3,3 42.6,3 42.85,2.75 43.55,2.75 43.65,2.65 45.75,2.65 46.1,2.3 48.1,2.3 49.2,1.2 U$5.20
SPI1_SCK_21
  Top 0.2: R7.1 40.8,4 41.1,3.7 45.8,3.7 46.9,2.6 46.9,1.22 U$5.19
  Bottom 0.2: UC1.P$21 33.9,4.8 35,3.7 35.9,3.7 36.2,3.4 37.1,3.4 37.15,3.35 37.7,3.35 37.95,3.1 38.7,3.1 38.8,3 40.05,3 40.3,2.75 41.05,2.75 41.15,2.65 42.45,2.65 42.7,2.4 43.4,2.4 43.5,2.3 45.6,2.3 46,1.9 46.8,1.9 46.9,1.8 46.9,1.2 U$5.19
SPI2_MISO_35
  Bottom 0.2: UC1.P$35 25.5,9 23.2,6.7 23.2,3.5 22.75,3.05 20.75,3.05 20.4,2.7 18.3,2.7 16.8,1.2 U$5.7
SPI2_MOSI_36
  Bottom 0.2: UC1.P$36 25.5,9.5 22.85,6.85 22.85,3.7 22.55,3.4 20.6,3.4 20.25,3.05 18.15,3.05 17.8,2.7 15.9,2.7 14.4,1.2 U$5.6
SPI2_NSS_33
  Bottom 0.2: UC1.P$33 25.5,8 23.9,6.4 23.9,3.2 21.9,1.2 U$5.9
SPI2_SCK_34
  Bottom 0.2: UC1.P$34 25.5,8.5 23.55,6.55 23.55,3.35 22.9,2.7 20.9,2.7 19.4,1.2 U$5.8
SWCLK_49
  Bottom 0.2: UC1.P$49 28.4,18.3 28.25,18.45 27.65,18.45 27.4,18.7 23.35,18.7 22.85,18.2 U$1.3
SWDAT_46
  Bottom 0.2: UC1.P$46 18.5,14.5 17.2,15.8 17.2,18.2 U$1.1
USART1_RX_43
  Bottom 0.2: UC1.P$43 25.6,13 25.15,13.45 18.05,13.45 12.7,18.8 11,18.8 10.15,19.65 8.15,19.65 7.9,19.9 5.8,19.9 4.2,21.5 U$3.2
USART1_TX_42
  Bottom 0.2: UC1.P$42 25.6,12.5 25,13.1 17.9,13.1 12.55,18.45 10.85,18.45 10,19.3 8,19.3 7.75,19.55 5.65,19.55 5.3,19.9 3.4,19.9 1.8,21.5 U$3.1
USART2_CTS_14
  Bottom 0.2: UC1.P$14 38.7,9 39.5,8.2 52.4,8.2 59.4,1.2 U$5.24
USART2_RTS_15
  Bottom 0.2: UC1.P$15 38.7,8.5 39.35,7.85 52.25,7.85 56.7,3.4 56.7,1.2 U$5.23
USART2_RX_17
  Bottom 0.2: UC1.P$17 35.9,5.8 47.2,5.8 51.8,1.2 U$5.21
USART2_TX_16
  Bottom 0.2: UC1.P$16 38.7,8 39.2,7.5 52.1,7.5 54.6,5 54.6,1.2 U$5.22
USBDM_44
  Top 0.2: U$3.3 6.8,21.5 8.3,20 9.3,20 10.7,18.6 12.8,18.6 13.3,18.1 ESD1.5
  Bottom 0.2: UC1.P$44 25.6,13.5 25.3,13.8 18.2,13.8 12.85,19.15 11.15,19.15 10.3,20 8.3,20 6.8,21.5 U$3.3
USBDP_45
  Top 0.2: U$3.4 9.3,21.5 11.3,19.5 13,19.5 14.25,18.25 ESD1.4
  Bottom 0.2: UC1.P$45 25.6,14 25.45,14.15 18.35,14.15 13,19.5 11.3,19.5 9.3,21.5 U$3.4
VBAT
  Top 0.2: D1.C 48.9,17.4 48.2,16.7 45.5,16.7 U$6.2
  Bottom 0.2: UC1.P$1 38.7,15.5 39.35,16.15 41.45,16.15 42.15,16.85 43.65,16.85 44,17.2 U$6.2
VCC
  Top 0.3: R8.2 D1.A 47.7,13.8 47.7,9.4 47.1,8.8 32.6,8.8 32.1,8.3 32.1,5.35 31.6,4.85 26.5,4.85 26.3,5.05 26.3,11.7 | R5.1 R3.1 26.3,11.7 | 26.3,11.7 LD1.2 | U$4.2 17.45,16.55 17.4,16.6
  Top 0.5: U$3.6 13.9,20.7 15.4,19.2 15.4,17.4 16.2,16.6 17.4,16.6 17.4,11.2 C3.+ 20.2,11.2 20.7,11.7 C16.1 LD1.2
  Bottom 0.3: UC1.P$19 34.9,4.9 35.35,4.45 39.8,4.45 | 39.8,4.45 41.8,4.45 C15.2 | L2.2 39.8,4.45
  Bottom 0.35: UC1.P$19 34.9,6.8 28.4,6.8 | 28.4,15.5 34.7,15.5 35.9,16.7 UC1.P$64 36.94,17.69 C14.2 | 28.4,6.8 28.4,15.5 | 28.4,15.5 UC1.P$48 26.26,16.8 | 28.4,6.8 UC1.P$32 C7.2 | U$3.6 14.2,21.5 15.7,20 17.4,20 18,19.4 20,19.4 21,18.4 21,17.75 21.6,17.15 22.45,17.15 23.55,18.25 26.1,18.25 26.26,18.09 26.26,16.8 | C6.2 26.2,16.86 26.26,16.8
VCC_IN
  Top 0.4: 21,9.4 20.7,9.4 20.3,9 13.6,9 12.1,10.5 12.1,11.4 11.7,11.8 D2.C D3.C | 21,9.4 LD1.3 | C17.1 20.95,9.28 arc-45 21,9.4
VDD
  Bottom 0.35: C5.2 UC1.P$13 37.2,9.5 37.1,9.4 37.1,7.6 37.25,7.45 38.55,7.45 39.5,6.5 L2.1

### Text on the board
Top: R9F1SE
tPlace: 0 | 1 | 2 | 3 | GND | 3.3V | 4 | 5 | 6 | 7 | 8 | 9 | 10 | 11 | 12 | 13 | 14 | 15 | 16 | RST | 17 | 18 | 19 | 20 | 46 | GND | 47 | SWD | GND | VBAT | 21 | 45 | 44 | 43 | 42 | 41 | 40 | 39 | 38 | 37 | 36 | 35 | 34 | 33 | 32 | 31 | 30 | 29 | 28 | 27 | 26 | 25 | 24 | 23 | 22